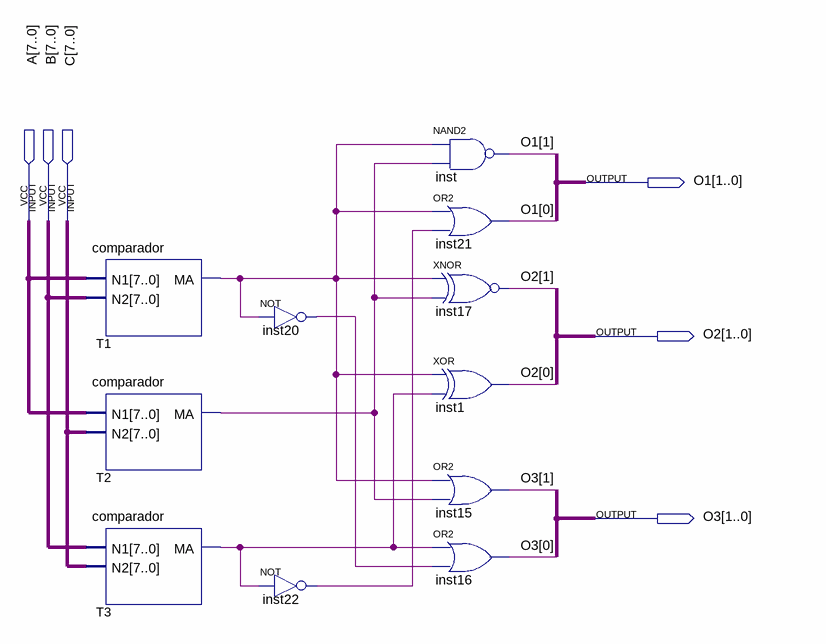
[diagram p0: schematic sheet]
// Quartus schematic modulo_comparador.bdf as structural Verilog: 11 symbols, 6 pins
module modulo_comparador (
  input  [7:0] A,
  input  [7:0] B,
  input  [7:0] C,
  output [1:0] O1,
  output [1:0] O2,
  output [1:0] O3
);

  wire inst20_out, inst22_out, T1_ma, T2_ma, T3_ma;

  comparador T1 (.N1(A), .N2(B), .MA(T1_ma));
  comparador T2 (.N1(A), .N2(C), .MA(T2_ma));
  comparador T3 (.N1(B), .N2(C), .MA(T3_ma));
  not inst20 (inst20_out, T1_ma);
  not inst22 (inst22_out, T3_ma);
  nand inst (O1[1], T1_ma, T2_ma);
  or inst21 (O1[0], T1_ma, inst22_out);
  xnor inst17 (O2[1], T1_ma, T2_ma);
  xor inst1 (O2[0], T1_ma, T3_ma);
  or inst15 (O3[1], T1_ma, T2_ma);
  or inst16 (O3[0], T3_ma, inst20_out);
endmodule
